# EAGLE schematic ct-Motor (EAGLE 4.15)
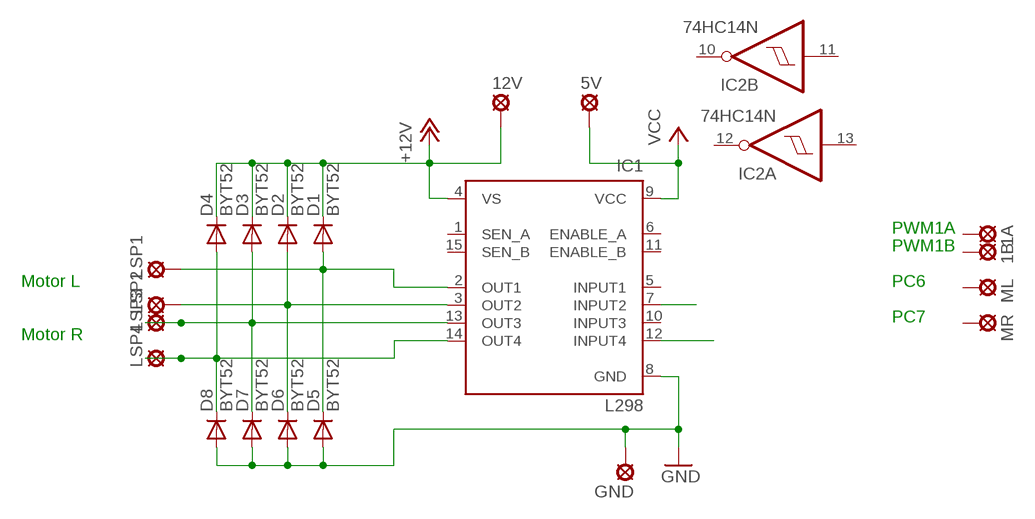
[diagram p0: schematic, sheet 1]

## Parts
1A  LSP10  [LSP10]
1B  LSP10  [LSP10]
5V  LSP10  [LSP10]
12V  LSP10  [LSP10]
D1  BYT52  [SGA-10]
D2  BYT52  [SGA-10]
D3  BYT52  [SGA-10]
D4  BYT52  [SGA-10]
D5  BYT52  [SGA-10]
D6  BYT52  [SGA-10]
D7  BYT52  [SGA-10]
D8  BYT52  [SGA-10]
GND  LSP10  [LSP10]
IC1  L298  [MULTIWATT-15]
IC2  74HC14N  [DIL14]
LSP1  LSP10  [LSP10]
LSP2  LSP10  [LSP10]
LSP3  LSP10  [LSP10]
LSP4  LSP10  [LSP10]
ML  LSP10  [LSP10]
MR  LSP10  [LSP10]

## Nets
+12V: 12V.MP D1.C D2.C D3.C D4.C IC1.4(VS)
GND: D5.A D6.A D7.A D8.A GND.MP IC1.8(GND)
N$1: D1.A D5.C IC1.2(OUT1) LSP1.MP
N$2: IC1.7(INPUT2)
N$3: D2.A D6.C IC1.3(OUT2) LSP2.MP
N$4: IC1.12(INPUT4)
N$5: D3.A D7.C IC1.13(OUT3) LSP3.MP
N$6: D4.A D8.C IC1.14(OUT4) LSP4.MP
VCC: 5V.MP IC1.9(VCC)
Unconnected: 1A.MP 1B.MP IC1.1(SEN_A) IC1.5(INPUT1) IC1.6(ENABLE_A) IC1.10(INPUT3) IC1.11(ENABLE_B) IC1.15(SEN_B) IC2.1(D:I) IC2.2(D:O) IC2.3(E:I) IC2.4(E:O) IC2.5(F:I) IC2.6(F:O) IC2.8(C:O) IC2.9(C:I) IC2.10(B:O) IC2.11(B:I) IC2.12(A:O) IC2.13(A:I) ML.MP MR.MP

## Notes on the sheet
- PWM1A
- PWM1B
- Motor L | PC6
- PC7
- Motor R

## Power pins joined to a net without a drawn wire
GND: IC2.7(P:GND)
VCC: IC2.14(P:VCC)

## Library data of the parts
1A 1B 5V 12V GND LSP1-LSP4 ML MR = solpad:LSP10: SOLDER PAD drill 1.0 mm, distributor Buerklin, 12H555
D1-D8 = diode:BYT52: DIODE fast silicon-mesa rectifier (Vishay Telefunken)
IC1 = st-microelectronics:L298: DUAL FULL-BRIDGE DRIVER
IC2 = 74xx-eu:74*14: Hex schmitt trigger INVERTER